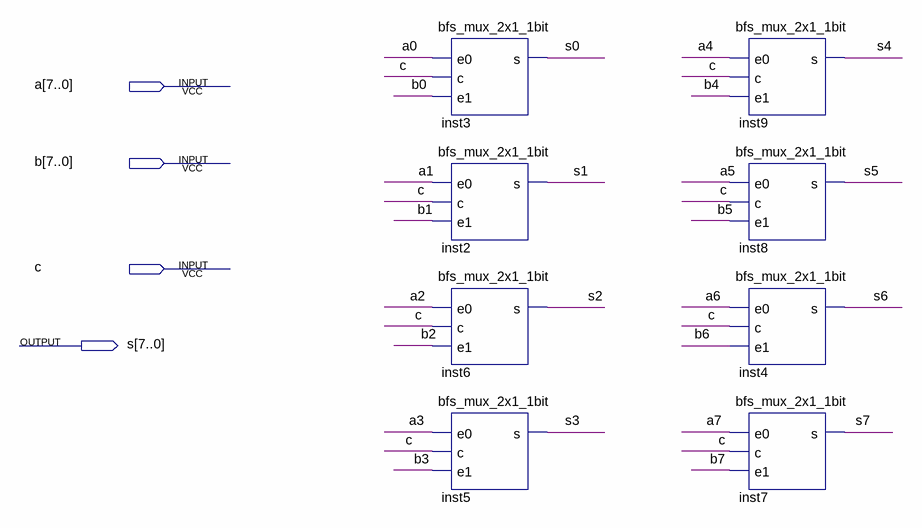
[diagram p0: schematic sheet]
// Quartus schematic bfs_mux_2x1_8bits.bdf as structural Verilog: 8 symbols, 4 pins
module bfs_mux_2x1_8bits (
  input  [7:0] a,
  input  [7:0] b,
  input  c,
  output [7:0] s
);

  bfs_mux_2x1_1bit inst3 (.e0(a[0]), .c(c), .e1(b[0]), .s(s[0]));
  bfs_mux_2x1_1bit inst2 (.e0(a[1]), .c(c), .e1(b[1]), .s(s[1]));
  bfs_mux_2x1_1bit inst6 (.e0(a[2]), .c(c), .e1(b[2]), .s(s[2]));
  bfs_mux_2x1_1bit inst5 (.e0(a[3]), .c(c), .e1(b[3]), .s(s[3]));
  bfs_mux_2x1_1bit inst9 (.e0(a[4]), .c(c), .e1(b[4]), .s(s[4]));
  bfs_mux_2x1_1bit inst8 (.e0(a[5]), .c(c), .e1(b[5]), .s(s[5]));
  bfs_mux_2x1_1bit inst4 (.e0(a[6]), .c(c), .e1(b[6]), .s(s[6]));
  bfs_mux_2x1_1bit inst7 (.e0(a[7]), .c(c), .e1(b[7]), .s(s[7]));
endmodule
